# Altium schematic sheet PowerSupply.SchDoc: Power Supply
size A2; DrawnBy: Patrik Staudenmayer; DocumentNumber: 4; SheetNumber: 4; SheetTotal: 15
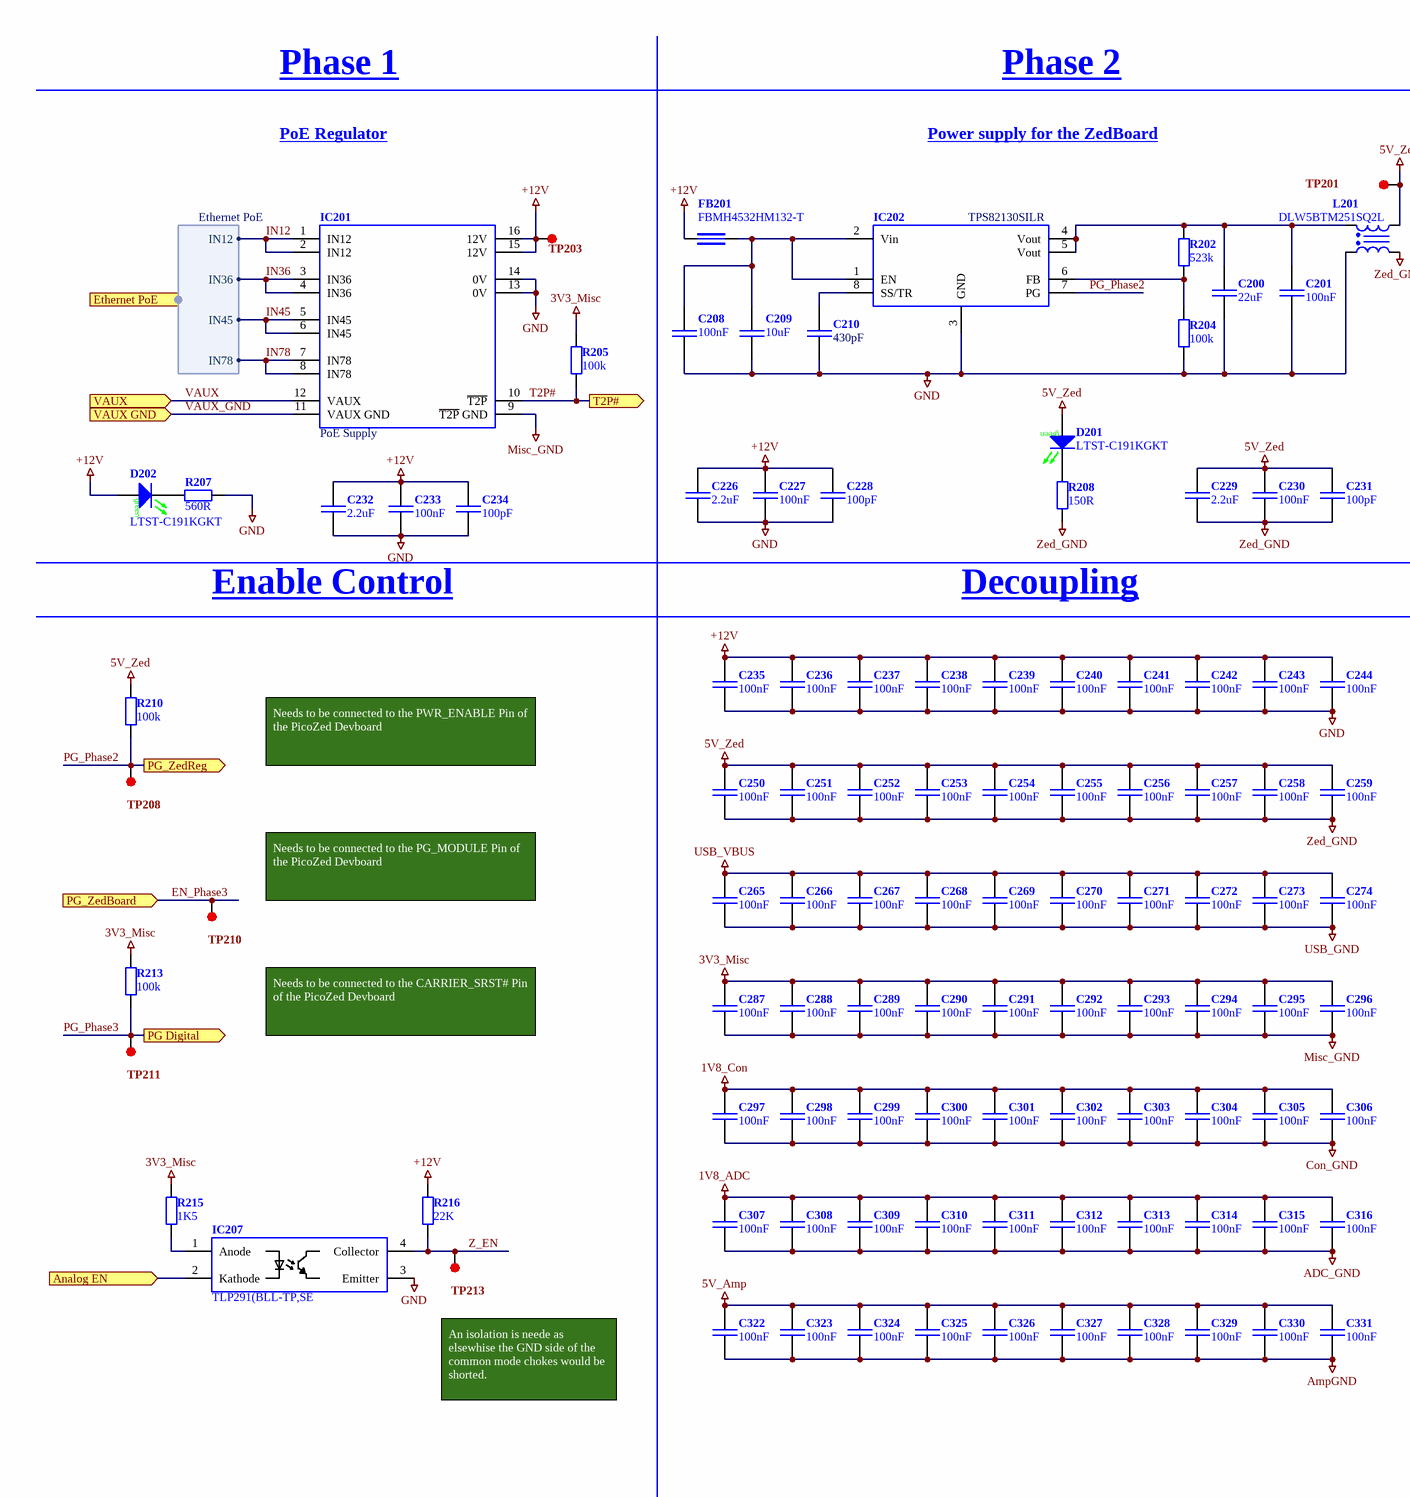
[diagram p0: PowerSupply.SchDoc, left]
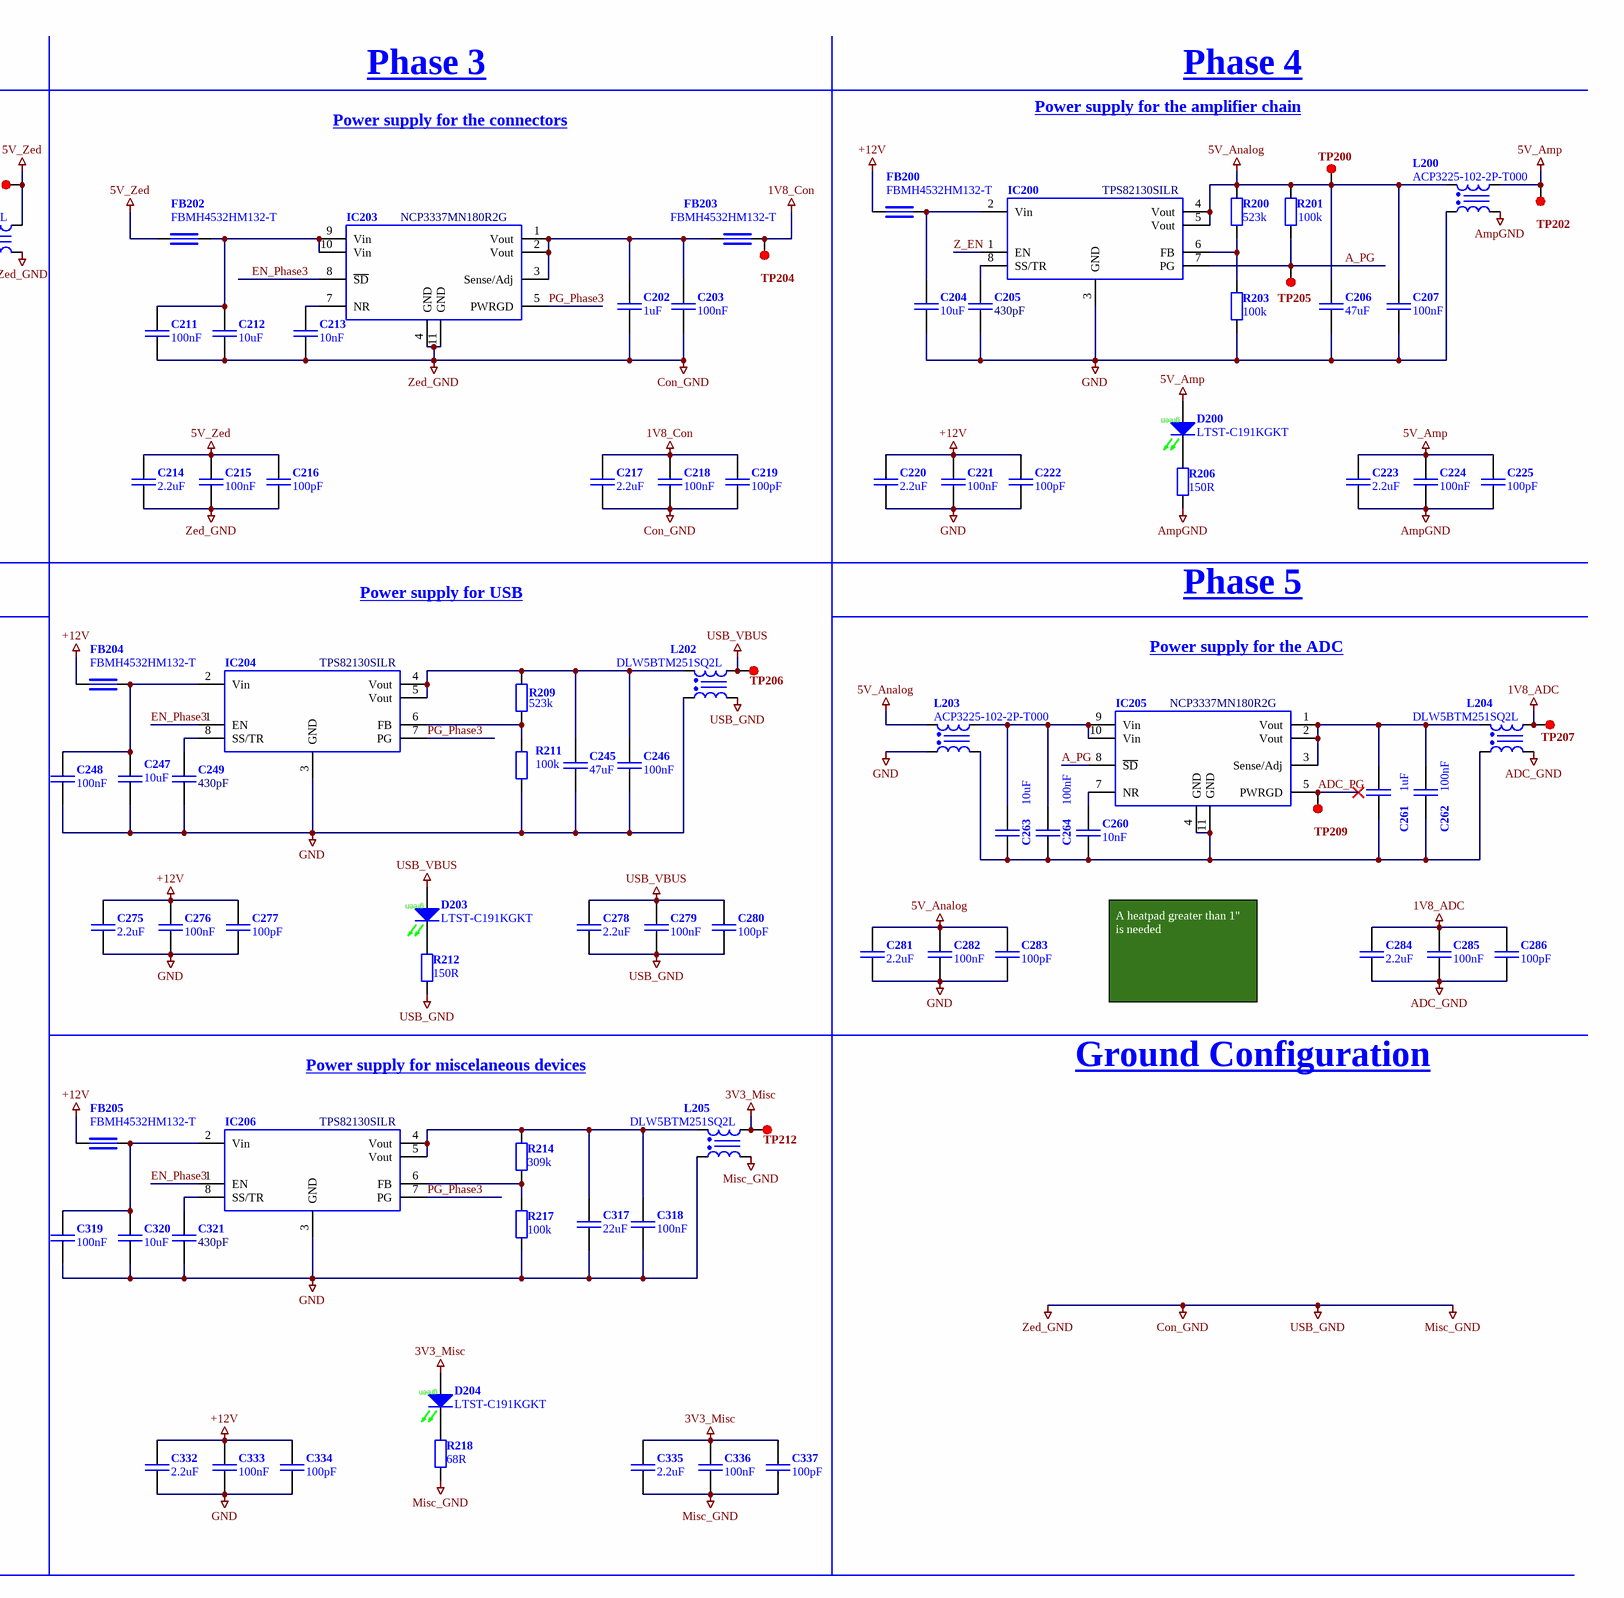
[diagram p1: PowerSupply.SchDoc, right]

## Parts
C200  22uF  [C_0805_N [CAPC2013N IPC]]
C201  100nF  [C_0603_N [CAPC1608N IPC]]
C202  1uF  [C_0603_N [CAPC1608N IPC]]
C203  100nF  [C_0603_N [CAPC1608N IPC]]
C204  10uF  [C_1210_N [CAPC3225N IPC]]
C205  430pF  [C_0603_N [CAPC1608N IPC]]
C206  47uF  [C_0805_N [CAPC2013N IPC]]
C207  100nF  [C_0603_N [CAPC1608N IPC]]
C208  100nF  [C_0603_N [CAPC1608N IPC]]
C209  10uF  [C_1210_N [CAPC3225N IPC]]
C210  430pF  [C_0603_N [CAPC1608N IPC]]
C211  100nF  [C_0603_N [CAPC1608N IPC]]
C212  10uF  [C_0603_N [CAPC1608N IPC]]
C213  10nF  [C_0603_N [CAPC1608N IPC]]
C214  2.2uF  [C_1206_N [CAPC3216N IPC]]
C215  100nF  [C_0805_N [CAPC2013N IPC]]
C216  100pF  [C_0603_N [CAPC1608N IPC]]
C217  2.2uF  [C_1206_N [CAPC3216N IPC]]
C218  100nF  [C_0805_N [CAPC2013N IPC]]
C219  100pF  [C_0603_N [CAPC1608N IPC]]
C220  2.2uF  [C_1206_N [CAPC3216N IPC]]
C221  100nF  [C_0805_N [CAPC2013N IPC]]
C222  100pF  [C_0603_N [CAPC1608N IPC]]
C223  2.2uF  [C_1206_N [CAPC3216N IPC]]
C224  100nF  [C_0805_N [CAPC2013N IPC]]
C225  100pF  [C_0603_N [CAPC1608N IPC]]
C226  2.2uF  [C_1206_N [CAPC3216N IPC]]
C227  100nF  [C_0805_N [CAPC2013N IPC]]
C228  100pF  [C_0603_N [CAPC1608N IPC]]
C229  2.2uF  [C_1206_N [CAPC3216N IPC]]
C230  100nF  [C_0805_N [CAPC2013N IPC]]
C231  100pF  [C_0603_N [CAPC1608N IPC]]
C232  2.2uF  [C_1206_N [CAPC3216N IPC]]
C233  100nF  [C_0805_N [CAPC2013N IPC]]
C234  100pF  [C_0603_N [CAPC1608N IPC]]
C235  100nF  [C_0603_N [CAPC1608N IPC]]
C236  100nF  [C_0603_N [CAPC1608N IPC]]
C237  100nF  [C_0603_N [CAPC1608N IPC]]
C238  100nF  [C_0603_N [CAPC1608N IPC]]
C239  100nF  [C_0603_N [CAPC1608N IPC]]
C240  100nF  [C_0603_N [CAPC1608N IPC]]
C241  100nF  [C_0603_N [CAPC1608N IPC]]
C242  100nF  [C_0603_N [CAPC1608N IPC]]
C243  100nF  [C_0603_N [CAPC1608N IPC]]
C244  100nF  [C_0603_N [CAPC1608N IPC]]
C245  47uF  [C_0603_N [CAPC1608N IPC]]
C246  100nF  [C_0603_N [CAPC1608N IPC]]
C247  10uF  [C_1210_N [CAPC3225N IPC]]
C248  100nF  [C_0603_N [CAPC1608N IPC]]
C249  430pF  [C_0603_N [CAPC1608N IPC]]
C250  100nF  [C_0603_N [CAPC1608N IPC]]
C251  100nF  [C_0603_N [CAPC1608N IPC]]
C252  100nF  [C_0603_N [CAPC1608N IPC]]
C253  100nF  [C_0603_N [CAPC1608N IPC]]
C254  100nF  [C_0603_N [CAPC1608N IPC]]
C255  100nF  [C_0603_N [CAPC1608N IPC]]
C256  100nF  [C_0603_N [CAPC1608N IPC]]
C257  100nF  [C_0603_N [CAPC1608N IPC]]
C258  100nF  [C_0603_N [CAPC1608N IPC]]
C259  100nF  [C_0603_N [CAPC1608N IPC]]
C260  10nF  [C_0603_N [CAPC1608N IPC]]
C261  1uF  [C_0603_N [CAPC1608N IPC]]
C262  100nF  [C_0603_N [CAPC1608N IPC]]
C263  10uF  [C_0603_N [CAPC1608N IPC]]
C264  100nF  [C_0603_N [CAPC1608N IPC]]
C265  100nF  [C_0603_N [CAPC1608N IPC]]
C266  100nF  [C_0603_N [CAPC1608N IPC]]
C267  100nF  [C_0603_N [CAPC1608N IPC]]
C268  100nF  [C_0603_N [CAPC1608N IPC]]
C269  100nF  [C_0603_N [CAPC1608N IPC]]
C270  100nF  [C_0603_N [CAPC1608N IPC]]
C271  100nF  [C_0603_N [CAPC1608N IPC]]
C272  100nF  [C_0603_N [CAPC1608N IPC]]
C273  100nF  [C_0603_N [CAPC1608N IPC]]
C274  100nF  [C_0603_N [CAPC1608N IPC]]
C275  2.2uF  [C_1206_N [CAPC3216N IPC]]
C276  100nF  [C_0805_N [CAPC2013N IPC]]
C277  100pF  [C_0603_N [CAPC1608N IPC]]
C278  2.2uF  [C_1206_N [CAPC3216N IPC]]
C279  100nF  [C_0805_N [CAPC2013N IPC]]
C280  100pF  [C_0603_N [CAPC1608N IPC]]
C281  2.2uF  [C_1206_N [CAPC3216N IPC]]
C282  100nF  [C_0805_N [CAPC2013N IPC]]
C283  100pF  [C_0603_N [CAPC1608N IPC]]
C284  2.2uF  [C_1206_N [CAPC3216N IPC]]
C285  100nF  [C_0805_N [CAPC2013N IPC]]
C286  100pF  [C_0603_N [CAPC1608N IPC]]
C287  100nF  [C_0603_N [CAPC1608N IPC]]
C288  100nF  [C_0603_N [CAPC1608N IPC]]
C289  100nF  [C_0603_N [CAPC1608N IPC]]
C290  100nF  [C_0603_N [CAPC1608N IPC]]
C291  100nF  [C_0603_N [CAPC1608N IPC]]
C292  100nF  [C_0603_N [CAPC1608N IPC]]
C293  100nF  [C_0603_N [CAPC1608N IPC]]
C294  100nF  [C_0603_N [CAPC1608N IPC]]
C295  100nF  [C_0603_N [CAPC1608N IPC]]
C296  100nF  [C_0603_N [CAPC1608N IPC]]
C297  100nF  [C_0603_N [CAPC1608N IPC]]
C298  100nF  [C_0603_N [CAPC1608N IPC]]
C299  100nF  [C_0603_N [CAPC1608N IPC]]
C300  100nF  [C_0603_N [CAPC1608N IPC]]
C301  100nF  [C_0603_N [CAPC1608N IPC]]
C302  100nF  [C_0603_N [CAPC1608N IPC]]
C303  100nF  [C_0603_N [CAPC1608N IPC]]
C304  100nF  [C_0603_N [CAPC1608N IPC]]
C305  100nF  [C_0603_N [CAPC1608N IPC]]
C306  100nF  [C_0603_N [CAPC1608N IPC]]
C307  100nF  [C_0603_N [CAPC1608N IPC]]
C308  100nF  [C_0603_N [CAPC1608N IPC]]
C309  100nF  [C_0603_N [CAPC1608N IPC]]
C310  100nF  [C_0603_N [CAPC1608N IPC]]
C311  100nF  [C_0603_N [CAPC1608N IPC]]
C312  100nF  [C_0603_N [CAPC1608N IPC]]
C313  100nF  [C_0603_N [CAPC1608N IPC]]
C314  100nF  [C_0603_N [CAPC1608N IPC]]
C315  100nF  [C_0603_N [CAPC1608N IPC]]
C316  100nF  [C_0603_N [CAPC1608N IPC]]
C317  22uF  [C_0805_N [CAPC2013N IPC]]
C318  100nF  [C_0603_N [CAPC1608N IPC]]
C319  100nF  [C_0603_N [CAPC1608N IPC]]
C320  10uF  [C_1210_N [CAPC3225N IPC]]
C321  430pF  [C_0603_N [CAPC1608N IPC]]
C322  100nF  [C_0603_N [CAPC1608N IPC]]
C323  100nF  [C_0603_N [CAPC1608N IPC]]
C324  100nF  [C_0603_N [CAPC1608N IPC]]
C325  100nF  [C_0603_N [CAPC1608N IPC]]
C326  100nF  [C_0603_N [CAPC1608N IPC]]
C327  100nF  [C_0603_N [CAPC1608N IPC]]
C328  100nF  [C_0603_N [CAPC1608N IPC]]
C329  100nF  [C_0603_N [CAPC1608N IPC]]
C330  100nF  [C_0603_N [CAPC1608N IPC]]
C331  100nF  [C_0603_N [CAPC1608N IPC]]
C332  2.2uF  [C_1206_N [CAPC3216N IPC]]
C333  100nF  [C_0805_N [CAPC2013N IPC]]
C334  100pF  [C_0603_N [CAPC1608N IPC]]
C335  2.2uF  [C_1206_N [CAPC3216N IPC]]
C336  100nF  [C_0805_N [CAPC2013N IPC]]
C337  100pF  [C_0603_N [CAPC1608N IPC]]
D200  LTST-C191KGKT  [LED_0603-GREEN_N_AK]
D201  LTST-C191KGKT  [LED_0603-GREEN_N_AK]
D202  LTST-C191KGKT  [LED_0603-GREEN_N_AK]
D203  LTST-C191KGKT  [LED_0603-GREEN_N_AK]
D204  LTST-C191KGKT  [LED_0603-GREEN_N_AK]
FB200  FBMH4532HM132-T  [L_1812_N [INDC4532X25N IPC]]
FB201  FBMH4532HM132-T  [L_1812_N [INDC4532X25N IPC]]
FB202  FBMH4532HM132-T  [L_1812_N [INDC4532X25N IPC]]
FB203  FBMH4532HM132-T  [L_1812_N [INDC4532X25N IPC]]
FB204  FBMH4532HM132-T  [L_1812_N [INDC4532X25N IPC]]
FB205  FBMH4532HM132-T  [L_1812_N [INDC4532X25N IPC]]
IC200  TPS82130SILR  [SIL0008D]
IC201  PoE Supply  [SREG_PoE_PowerSupply Prometheus]
IC202  TPS82130SILR  [SIL0008D]
IC203  NCP3337MN180R2G  [SON50P300X100_HS-11N]
IC204  TPS82130SILR  [SIL0008D]
IC205  NCP3337MN180R2G  [SON50P300X100_HS-11N]
IC206  TPS82130SILR  [SIL0008D]
IC207  TLP291(BLL-TP,SE  [SOP127P700X220-4N]
L200  ACP3225-102-2P-T000  [L_ACP3225-102-2P-T000]
L201  DLW5BTM251SQ2L  [L_COMMON_DLW5BTM251SQ2L Prometheus]
L202  DLW5BTM251SQ2L  [L_COMMON_DLW5BTM251SQ2L Prometheus]
L203  ACP3225-102-2P-T000  [L_ACP3225-102-2P-T000]
L204  DLW5BTM251SQ2L  [L_COMMON_DLW5BTM251SQ2L Prometheus]
L205  DLW5BTM251SQ2L  [L_COMMON_DLW5BTM251SQ2L Prometheus]
R200  523k  [R_0603_N [RESC1608N IPC]]
R201  100k  [R_0603_N [RESC1608N IPC]]
R202  523k  [R_0603_N [RESC1608N IPC]]
R203  100k  [R_0603_N [RESC1608N IPC]]
R204  100k  [R_0603_N [RESC1608N IPC]]
R205  100k  [R_0603_N [RESC1608N IPC]]
R206  150R  [R_0603_N [RESC1608N IPC]]
R207  560R  [R_0603_N [RESC1608N IPC]]
R208  150R  [R_0603_N [RESC1608N IPC]]
R209  523k  [R_0603_N [RESC1608N IPC]]
R210  100k  [R_0603_N [RESC1608N IPC]]
R211  100k  [R_0603_N [RESC1608N IPC]]
R212  150R  [R_0603_N [RESC1608N IPC]]
R213  100k  [R_0603_N [RESC1608N IPC]]
R214  309k  [R_0603_N [RESC1608N IPC]]
R215  1K5  [R_0603_N [RESC1608N IPC]]
R216  22K  [R_0603_N [RESC1608N IPC]]
R217  100k  [R_0603_N [RESC1608N IPC]]
R218  68R  [R_0603_N [RESC1608N IPC]]
TP200  TP_GENERIC  [TP_0.8_P100T]  (value not drawn)  (no BOM)
TP201  TP_GENERIC  [TP_0.8_P100T]  (value not drawn)  (no BOM)
TP202  TP_GENERIC  [TP_0.8_P100T]  (value not drawn)  (no BOM)
TP203  TP_GENERIC  [TP_0.8_P100T]  (value not drawn)  (no BOM)
TP204  TP_GENERIC  [TP_0.8_P100T]  (value not drawn)  (no BOM)
TP205  TP_GENERIC  [TP_0.8_P100T]  (value not drawn)  (no BOM)
TP206  TP_GENERIC  [TP_0.8_P100T]  (value not drawn)  (no BOM)
TP207  TP_GENERIC  [TP_0.8_P100T]  (value not drawn)  (no BOM)
TP208  TP_GENERIC  [TP_0.8_P100T]  (value not drawn)  (no BOM)
TP209  TP_GENERIC  [TP_0.8_P100T]  (value not drawn)  (no BOM)
TP210  TP_GENERIC  [TP_0.8_P100T]  (value not drawn)  (no BOM)
TP211  TP_GENERIC  [TP_0.8_P100T]  (value not drawn)  (no BOM)
TP212  TP_GENERIC  [TP_0.8_P100T]  (value not drawn)  (no BOM)
TP213  TP_GENERIC  [TP_0.8_P100T]  (value not drawn)  (no BOM)

## Ports
Analog EN (in), Ethernet PoE (harness Ethernet PoE), PG Digital (out), PG_ZedBoard (in), PG_ZedReg (out), T2P# (out), VAUX (in), VAUX GND (in)

## Harnesses
Ethernet PoE: IN12, IN36, IN45, IN78

## Nets
1V8_ADC: C284.1 C285.1 C286.1 C307.1 C308.1 C309.1 C310.1 C311.1 C312.1 C313.1 C314.1 C315.1 C316.1 L204.3 TP207.1
1V8_Con: C217.1 C218.1 C219.1 C297.1 C298.1 C299.1 C300.1 C301.1 C302.1 C303.1 C304.1 C305.1 C306.1 FB203.1 TP204.1
3V3_Misc: C287.1 C288.1 C289.1 C290.1 C291.1 C292.1 C293.1 C294.1 C295.1 C296.1 C335.1 C336.1 C337.1 D204.A L205.3 R205.2 R213.2 R215.1 TP212.1
5V_Amp: C223.1 C224.1 C225.1 C322.1 C323.1 C324.1 C325.1 C326.1 C327.1 C328.1 C329.1 C330.1 C331.1 D200.A L200.3 TP202.1
5V_Analog: C206.1 C207.1 C281.1 C282.1 C283.1 IC200.4(Vout) IC200.5(Vout) L200.2 L203.2 R200.2 R201.2 TP200.1
5V_Zed: C214.1 C215.1 C216.1 C229.1 C230.1 C231.1 C250.1 C251.1 C252.1 C253.1 C254.1 C255.1 C256.1 C257.1 C258.1 C259.1 D201.A FB202.2 L201.3 R210.2 TP201.1
+12V: C220.1 C221.1 C222.1 C226.1 C227.1 C228.1 C232.1 C233.1 C234.1 C235.1 C236.1 C237.1 C238.1 C239.1 C240.1 C241.1 C242.1 C243.1 C244.1 C275.1 C276.1 C277.1 C332.1 C333.1 C334.1 D202.A FB200.2 FB201.2 FB204.2 FB205.2 IC201.15(12V) IC201.16(12V) R216.1 TP203.1
ADC_GND: C284.2 C285.2 C286.2 C307.2 C308.2 C309.2 C310.2 C311.2 C312.2 C313.2 C314.2 C315.2 C316.2 L204.2
AmpGND: C223.2 C224.2 C225.2 C322.2 C323.2 C324.2 C325.2 C326.2 C327.2 C328.2 C329.2 C330.2 C331.2 L200.4 R206.1
Con_GND: C202.2 C203.2 C211.2 C212.2 C213.2 C214.2 C215.2 C216.2 C217.2 C218.2 C219.2 C229.2 C230.2 C231.2 C250.2 C251.2 C252.2 C253.2 C254.2 C255.2 C256.2 C257.2 C258.2 C259.2 C265.2 C266.2 C267.2 C268.2 C269.2 C270.2 C271.2 C272.2 C273.2 C274.2 C278.2 C279.2 C280.2 C287.2 C288.2 C289.2 C290.2 C291.2 C292.2 C293.2 C294.2 C295.2 C296.2 C297.2 C298.2 C299.2 C300.2 C301.2 C302.2 C303.2 C304.2 C305.2 C306.2 C335.2 C336.2 C337.2 IC201.9(~{T2P}_GND) IC203.4(GND) IC203.11(GND) L201.2 L202.2 L205.2 R208.1 R212.1 R218.1  [also labelled Misc_GND, USB_GND, Zed_GND]
GND: C200.2 C201.2 C204.2 C205.2 C206.2 C207.2 C208.2 C209.2 C210.2 C220.2 C221.2 C222.2 C226.2 C227.2 C228.2 C232.2 C233.2 C234.2 C235.2 C236.2 C237.2 C238.2 C239.2 C240.2 C241.2 C242.2 C243.2 C244.2 C245.2 C246.2 C247.2 C248.2 C249.2 C275.2 C276.2 C277.2 C281.2 C282.2 C283.2 C317.2 C318.2 C319.2 C320.2 C321.2 C332.2 C333.2 C334.2 IC200.3(GND) IC201.13(0V) IC201.14(0V) IC202.3(GND) IC204.3(GND) IC206.3(GND) IC207.3(Emitter) L200.1 L201.1 L202.1 L203.1 L205.1 R203.1 R204.1 R207.1 R211.1 R217.1
USB_VBUS: C265.1 C266.1 C267.1 C268.1 C269.1 C270.1 C271.1 C272.1 C273.1 C274.1 C278.1 C279.1 C280.1 D203.A L202.3 TP206.1
A_PG: IC200.7(PG) IC205.8(~{SD}) R201.1 TP205.1
ADC_PG: IC205.5(PWRGD) TP209.1
Analog EN: IC207.2(Kathode) ; port Analog EN
EN_Phase3: IC203.8(~{SD}) IC204.1(EN) IC206.1(EN) TP210.1 ; port PG_ZedBoard
IN12: IC201.1(IN12) IC201.2(IN12) ; port Ethernet PoE.IN12
IN36: IC201.3(IN36) IC201.4(IN36) ; port Ethernet PoE.IN36
IN45: IC201.5(IN45) IC201.6(IN45) ; port Ethernet PoE.IN45
IN78: IC201.7(IN78) IC201.8(IN78) ; port Ethernet PoE.IN78
PG_Phase2: IC202.7(PG) R210.1 TP208.1 ; port PG_ZedReg
PG_Phase3: IC203.5(PWRGD) IC204.7(PG) IC206.7(PG) R213.1 TP211.1 ; port PG Digital
T2P#: IC201.10(~{T2P}) R205.1 ; port T2P#
VAUX: IC201.12(VAUX) ; port VAUX
VAUX_GND: IC201.11(VAUX_GND) ; port VAUX GND
Z_EN: IC200.1(EN) IC207.4(Collector) R216.2 TP213.1
NetC200_1: C200.1 C201.1 IC202.4(Vout) IC202.5(Vout) L201.4 R202.2
NetC202_1: C202.1 C203.1 FB203.2 IC203.1(Vout) IC203.2(Vout) IC203.3(Sense/Adj)
NetC204_1: C204.1 FB200.1 IC200.2(Vin)
NetC205_1: C205.1 IC200.8(SS/TR)
NetC208_1: C208.1 C209.1 FB201.1 IC202.1(EN) IC202.2(Vin)
NetC210_1: C210.1 IC202.8(SS/TR)
NetC211_1: C211.1 C212.1 FB202.1 IC203.9(Vin) IC203.10(Vin)
NetC213_1: C213.1 IC203.7(NR)
NetC245_1: C245.1 C246.1 IC204.4(Vout) IC204.5(Vout) L202.4 R209.2
NetC247_1: C247.1 C248.1 FB204.1 IC204.2(Vin)
NetC249_1: C249.1 IC204.8(SS/TR)
NetC260_1: C260.1 IC205.7(NR)
NetC260_2: C260.2 C261.2 C262.2 C263.2 C264.2 IC205.4(GND) IC205.11(GND) L203.4 L204.1
NetC261_1: C261.1 C262.1 IC205.1(Vout) IC205.2(Vout) IC205.3(Sense/Adj) L204.4
NetC263_1: C263.1 C264.1 IC205.9(Vin) IC205.10(Vin) L203.3
NetC317_1: C317.1 C318.1 IC206.4(Vout) IC206.5(Vout) L205.4 R214.2
NetC319_1: C319.1 C320.1 FB205.1 IC206.2(Vin)
NetC321_1: C321.1 IC206.8(SS/TR)
NetD200_K: D200.K R206.2
NetD201_K: D201.K R208.2
NetD202_K: D202.K R207.2
NetD203_K: D203.K R212.2
NetD204_K: D204.K R218.2
NetIC200_6: IC200.6(FB) R200.1 R203.2
NetIC202_6: IC202.6(FB) R202.1 R204.2
NetIC204_6: IC204.6(FB) R209.1 R211.2
NetIC206_6: IC206.6(FB) R214.1 R217.2
NetIC207_1: IC207.1(Anode) R215.2

## Notes on the sheet
- Phase 1
- Phase 2
- Phase 3
- Power supply for the amplifier chain
- Phase 4
- PoE Regulator
- Power supply for the ZedBoard
- Power supply for the connectors
- Enable Control
- Decoupling
- Power supply for USB
- Power supply for the ADC
- Phase 5
- Needs to be connected to the PWR_ENABLE Pin of the PicoZed Devboard
- Needs to be connected to the PG_MODULE Pin of the PicoZed Devboard
- Needs to be connected to the CARRIER_SRST# Pin of the PicoZed Devboard
- A heatpad greater than 1" is needed
- Power supply for miscelaneous devices
- Ground Configuration
- An isolation is neede as elsewhise the GND side of the common mode chokes would be shorted.
- Project:
- Title:
- Size:
- Date:
- File:
- A2
- Project ID:
- Time:
- Sheet
- Version:
- of
- Variant:
- (in symbol LED_GREEN_GENERIC) green

## Library data of the parts
C200-C337 = C_GENERIC: Prometheus_ID: *; Prometheus_Manufacturer: *
  C200 C317: Prometheus_ManPartNo: 22uF; Prometheus_Comment: 22uF; Prometheus_CurrentFootprint: C_0805_N [CAPC2013N IPC]
  C201 C203 C207 C208 C211 C235-C244 C246 C248 C250-C259 C262 C264-C274 C287-C316 C318 C319 C322-C331: Prometheus_ManPartNo: 100nF; Prometheus_Comment: 100nF; Prometheus_CurrentFootprint: C_0603_N [CAPC1608N IPC]
  C202 C261: Prometheus_ManPartNo: 1uF; Prometheus_Comment: 1uF; Prometheus_CurrentFootprint: C_0603_N [CAPC1608N IPC]
  C204 C209 C247 C320: Prometheus_ManPartNo: 10uF; Prometheus_Comment: 10uF; Prometheus_CurrentFootprint: C_1210_N [CAPC3225N IPC]
  C205 C210 C249 C321: Prometheus_ManPartNo: 430pF; Prometheus_Comment: 430pF; Prometheus_CurrentFootprint: C_0603_N [CAPC1608N IPC]
  C206: Prometheus_ManPartNo: 47uF; Prometheus_Comment: 47uF; Prometheus_CurrentFootprint: C_0805_N [CAPC2013N IPC]
  C212 C263: Prometheus_ManPartNo: 10uF; Prometheus_Comment: 10uF; Prometheus_CurrentFootprint: C_0603_N [CAPC1608N IPC]
  C213 C260: Prometheus_ManPartNo: 10nF; Prometheus_Comment: 10nF; Prometheus_CurrentFootprint: C_0603_N [CAPC1608N IPC]
  C214 C217 C220 C223 C226 C229 C232 C275 C278 C281 C284 C332 C335: Prometheus_ManPartNo: 2.2uF; Prometheus_Comment: 2.2uF; Prometheus_CurrentFootprint: C_1206_N [CAPC3216N IPC]
  C215 C218 C221 C224 C227 C230 C233 C276 C279 C282 C285 C333 C336: Prometheus_ManPartNo: 100nF; Prometheus_Comment: 100nF; Prometheus_CurrentFootprint: C_0805_N [CAPC2013N IPC]
  C216 C219 C222 C225 C228 C231 C234 C277 C280 C283 C286 C334 C337: Prometheus_ManPartNo: 100pF; Prometheus_Comment: 100pF; Prometheus_CurrentFootprint: C_0603_N [CAPC1608N IPC]
  C245: Prometheus_ManPartNo: 47uF; Prometheus_Comment: 47uF; Prometheus_CurrentFootprint: C_0603_N [CAPC1608N IPC]
D200-D204 = LED_GREEN_GENERIC: Prometheus_Manufacturer: Lite-On Inc.; Prometheus_ID: *; Prometheus_ManPartNo: LTST-C191KGKT; Prometheus_Comment: LTST-C191KGKT; Prometheus_CurrentFootprint: LED_0603-GREEN_N_AK; ComponentLink1Description: Datasheet; ComponentLink1URL: https://optoelectronics.liteon.com/upload/download/DS22-2000-228/LTST-C191KGKT.PDF
FB200-FB205 = FB_FBMH4532HM132-T: 1,3 kOHM @ 100 MHz / 3 A / 60 mOHM; Prometheus_Manufacturer: Taiyo Yuden; Prometheus_ID: *; Prometheus_ManPartNo: FBMH4532HM132-T; Prometheus_Comment: FBMH4532HM132-T; Prometheus_CurrentFootprint: L_1812_N [INDC4532X25N IPC]
IC200 IC202 IC204 IC206 = SREG_TPS82130SILR: Step-Down DC/DC / Vin = 4 V to 17 V / Vout = 0.9 V to 6 V Adjustable / Iout = 3 A; Prometheus_Manufacturer: Texas Instruments; Prometheus_ManPartNo: TPS82130SILR; Prometheus_Comment: TPS82130SILR; Prometheus_CurrentFootprint: SIL0008D
IC201 = SREG_PoE_PowerSupply: Prometheus_Manufacturer: Prometheus; Prometheus_ManPartNo: PoE Supply; Prometheus_Comment: PoE Supply; Prometheus_CurrentFootprint: SREG_PoE_PowerSupply Prometheus
IC203 IC205 = LDO_NCP3337: LDO / Vin max. 16 V / Vout 1V8; Prometheus_Manufacturer: ON Semiconductor; Prometheus_ManPartNo: NCP3337MN180R2G; Prometheus_Comment: NCP3337MN180R2G; Prometheus_CurrentFootprint: SON50P300X100_HS-11N
IC207 = IC_TLP291(BLL-TP,SE: Opto-Isolator / min. VCE = 80 V / min. Current Transfer Ratio = 200 % @ 5 mA; Prometheus_Manufacturer: Toshiba; Prometheus_ManPartNo: TLP291(BLL-TP,SE; Prometheus_Comment: TLP291(BLL-TP,SE; Prometheus_CurrentFootprint: SOP127P700X220-4N
L200 L203 = L_COMMONMODE_CHOKE_744282010_1: Prometheus_Manufacturer: TDK Corporation; Prometheus_ID: *; Prometheus_ManPartNo: ACP3225-102-2P-T000; Prometheus_Comment: ACP3225-102-2P-T000; Prometheus_CurrentFootprint: L_ACP3225-102-2P-T000
L201 L202 L204 L205 = L_COMMONMODE_CHOKE_DLW5BTM251SQ2L: 250 OHM @ 100 MHz / I max. 5A / DCR max. 20 mOHM / VDC max. 50 V; Prometheus_Manufacturer: Murata Electronics; Prometheus_ID: *; Prometheus_ManPartNo: DLW5BTM251SQ2L; Prometheus_Comment: DLW5BTM251SQ2L; Prometheus_CurrentFootprint: L_COMMON_DLW5BTM251SQ2L Prometheus
R200-R218 = R_GENERIC_DIN: Prometheus_ID: *; Prometheus_Manufacturer: *; Prometheus_CurrentFootprint: R_0603_N [RESC1608N IPC]
  R200 R202 R209: Prometheus_ManPartNo: 523k; Prometheus_Comment: 523k
  R201 R203-R205 R210 R211 R213 R217: Prometheus_ManPartNo: 100k; Prometheus_Comment: 100k
  R206 R208 R212: Prometheus_ManPartNo: 150R; Prometheus_Comment: 150R
  R207: Prometheus_ManPartNo: 560R; Prometheus_Comment: 560R
  R214: Prometheus_ManPartNo: 309k; Prometheus_Comment: 309k
  R215: Prometheus_ManPartNo: 1K5; Prometheus_Comment: 1K5
  R216: Prometheus_ManPartNo: 22K; Prometheus_Comment: 22K
  R218: Prometheus_ManPartNo: 68R; Prometheus_Comment: 68R
TP200-TP213 = TP_GENERIC: Needle Test Point; Prometheus_ID: *; Prometheus_ManPartNo: TP_GENERIC; Prometheus_Manufacturer: *; Prometheus_Comment: TP_GENERIC; Prometheus_CurrentFootprint: TP_0.8_P100T